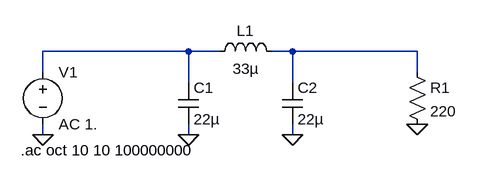
[diagram p0: schematic pi.asc]
pi.asc, the LTspice schematic file:
Version 4
SHEET 1 880 680
WIRE 128 96 -96 96
WIRE 176 96 128 96
WIRE 288 96 256 96
WIRE 480 96 288 96
WIRE -96 128 -96 96
WIRE 480 128 480 96
WIRE 128 144 128 96
WIRE 288 144 288 96
WIRE -96 224 -96 208
WIRE 128 224 128 208
WIRE 288 224 288 208
FLAG 288 224 0
FLAG 128 224 0
FLAG -96 224 0
FLAG 480 208 0
SYMBOL ind 160 112 R270
WINDOW 0 32 56 VTop 2
WINDOW 3 5 56 VBottom 2
SYMATTR InstName L1
SYMATTR Value 33µ
SYMBOL cap 112 144 R0
SYMATTR InstName C1
SYMATTR Value 22µ
SYMBOL cap 272 144 R0
SYMATTR InstName C2
SYMATTR Value 22µ
SYMBOL voltage -96 112 R0
WINDOW 123 0 0 Left 0
WINDOW 39 0 0 Left 0
SYMATTR InstName V1
SYMATTR Value AC 1.
SYMBOL res 464 112 R0
SYMATTR InstName R1
SYMATTR Value 220
TEXT -130 248 Left 2 !.ac oct 10 10 100000000

The netlist it stands for:
* pi.asc
L1 N001 N002 33µ
C1 N001 0 22µ
C2 N002 0 22µ
V1 N001 0 AC 1.
R1 N002 0 220
.ac oct 10 10 100000000
.backanno
.end